# Altium schematic sheet I2CExtIO.SchDoc: StepMotor Controller
size A4; Organization: NTUST EE-305; Address1: No.43, Sec. 4, Keelung Rd.; Address2: Da’an Dist.; Address3: Taipei 106; Address4: Taiwan (R.O.C.); DocumentNumber: 4; Revision: 1.0; SheetNumber: 4; SheetTotal: 8
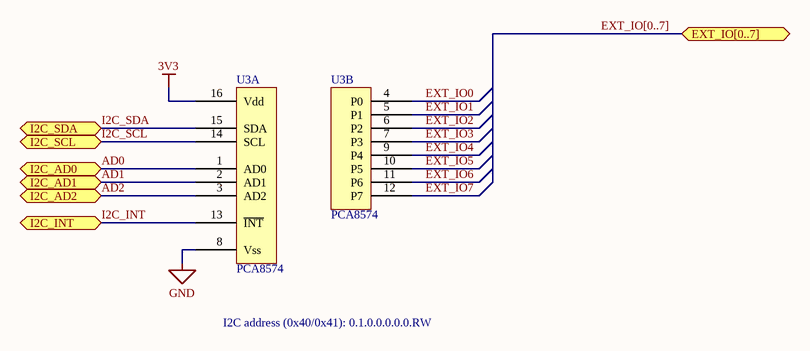
[diagram p0: I2CExtIO.SchDoc]

## Parts
U3  PCA8574  [TSSOP-ST16_N]  (parts A,B of 2)

## Ports
EXT_IO[0..7], I2C_AD0, I2C_AD1, I2C_AD2, I2C_INT, I2C_SCL, I2C_SDA

## Nets
3V3: U3.16(Vdd)
GND: U3.8(Vss)
AD0: U3.1(AD0) ; port I2C_AD0
AD1: U3.2(AD1) ; port I2C_AD1
AD2: U3.3(AD2) ; port I2C_AD2
EXT_IO0: U3.4(P0)
EXT_IO1: U3.5(P1)
EXT_IO2: U3.6(P2)
EXT_IO3: U3.7(P3)
EXT_IO4: U3.9(P4)
EXT_IO5: U3.10(P5)
EXT_IO6: U3.11(P6)
EXT_IO7: U3.12(P7)
I2C_INT: U3.13(~{INT}) ; port I2C_INT
I2C_SCL: U3.14(SCL) ; port I2C_SCL
I2C_SDA: U3.15(SDA) ; port I2C_SDA

## Buses and harness runs
bus EXT_IO[0..7] = port EXT_IO[0..7]

## Notes on the sheet
- I2C address (0x40/0x41): 0.1.0.0.0.0.0.RW
- Title
- Name
- Size:
- Revision:
- A4
- Date:
- Time:
- Sheet
- of

## Library data of the parts
U3 = PCA8574: Remote 8-bit I/O expander for I2C-bus with interrupt; Supplier 1: Digi-Key; Supplier Part Number 1: 568-4241-5-ND